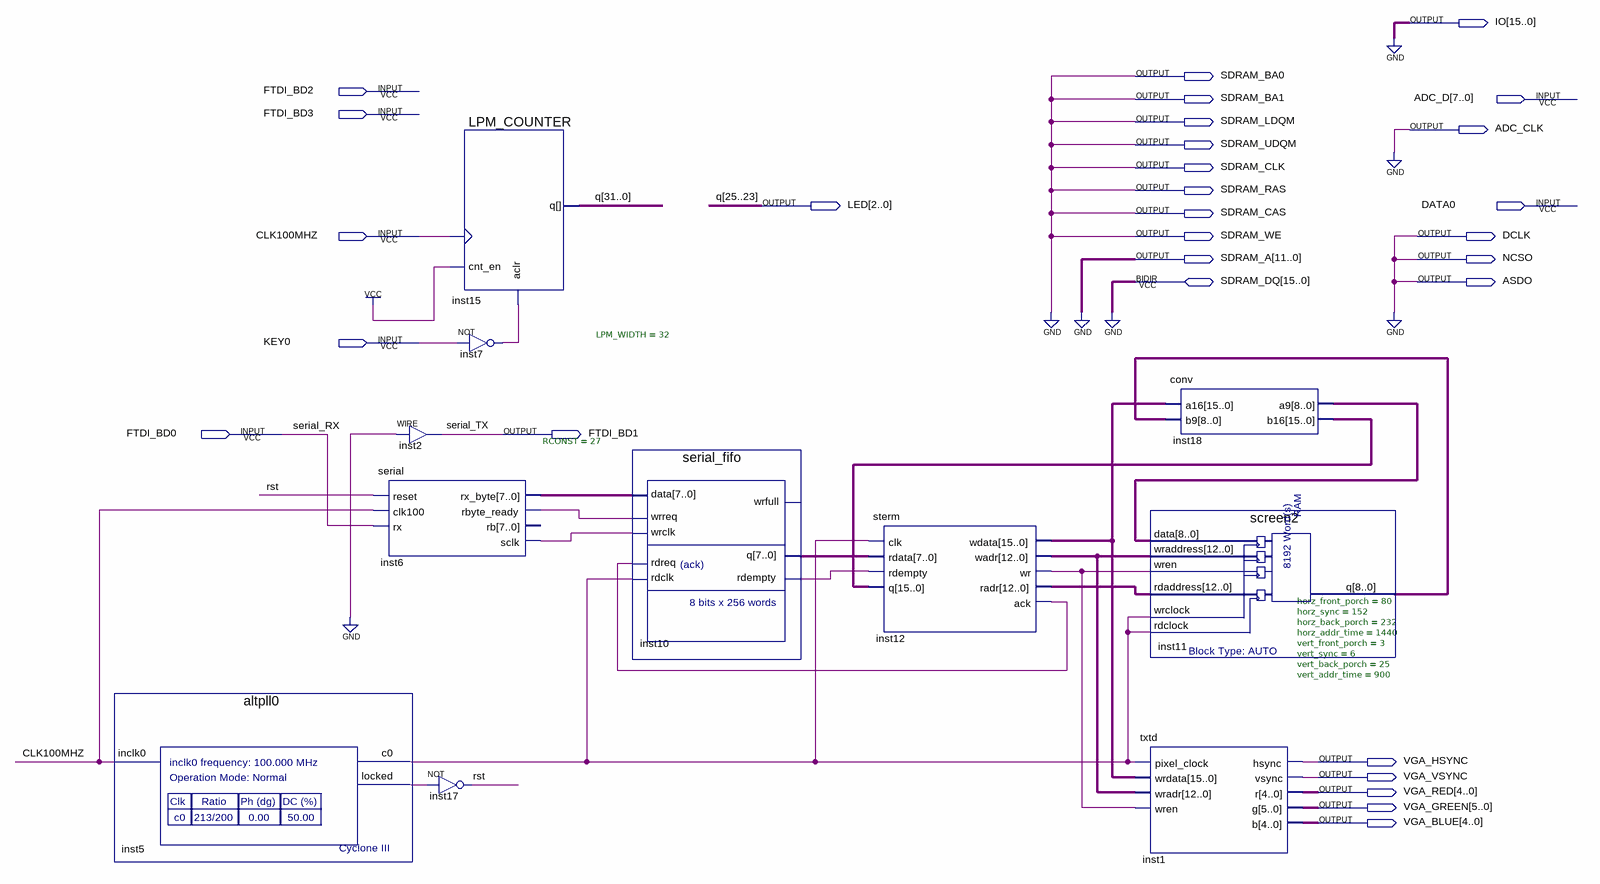
[diagram p0: schematic sheet]
// Quartus schematic cyclone3.bdf as structural Verilog: 11 symbols, 29 pins
module cyclone3 (
  input  FTDI_BD2,
  input  [7:0] ADC_D,
  input  FTDI_BD3,
  input  DATA0,
  input  CLK100MHZ,
  input  KEY0,
  input  FTDI_BD0,
  inout  [15:0] SDRAM_DQ,
  output [15:0] IO,
  output SDRAM_BA0,
  output SDRAM_BA1,
  output SDRAM_LDQM,
  output ADC_CLK,
  output SDRAM_UDQM,
  output SDRAM_CLK,
  output SDRAM_RAS,
  output [2:0] LED,
  output SDRAM_CAS,
  output SDRAM_WE,
  output DCLK,
  output [11:0] SDRAM_A,
  output NCSO,
  output ASDO,
  output FTDI_BD1,
  output VGA_HSYNC,
  output VGA_VSYNC,
  output [4:0] VGA_RED,
  output [5:0] VGA_GREEN,
  output [4:0] VGA_BLUE
);

  wire inst5_c0, inst5_locked, inst6_rbyte_ready, inst6_sclk, inst7_out, inst10_rdempty, inst12_ack,
       inst12_wr, rst;
  wire [7:0] inst6_rx_byte, inst10_q;
  wire [8:0] inst11_q, inst18_a9;
  wire [12:0] inst12_radr, inst12_wadr;
  wire [15:0] inst12_wdata, inst18_b16;
  wire [31:0] q;

  altpll0 inst5 (.inclk0(CLK100MHZ), .c0(inst5_c0), .locked(inst5_locked));
  assign FTDI_BD1 = 1'b0;  // WIRE inst2
  serial #(.RCONST(27)) inst6 (
    .reset(rst), .clk100(CLK100MHZ), .rx(FTDI_BD0), .rx_byte(inst6_rx_byte), .rbyte_ready(inst6_rbyte_ready),
    .sclk(inst6_sclk));  // open: rb
  LPM_COUNTER #(.LPM_WIDTH(32)) inst15 (
    .aclr(inst7_out), .clock(CLK100MHZ), .cnt_en(1'b1), .q({q[31:26], LED, q[22:0]}));
  not inst7 (inst7_out, KEY0);
  not inst17 (rst, inst5_locked);
  serial_fifo inst10 (
    .data(inst6_rx_byte), .wrreq(inst6_rbyte_ready), .wrclk(inst6_sclk), .rdreq(inst12_ack),
    .rdclk(inst5_c0), .q(inst10_q), .rdempty(inst10_rdempty));  // open: wrfull
  sterm inst12 (
    .clk(inst5_c0), .rdata(inst10_q), .rdempty(inst10_rdempty), .q(inst18_b16), .wdata(inst12_wdata),
    .wadr(inst12_wadr), .wr(inst12_wr), .radr(inst12_radr), .ack(inst12_ack));
  screen2 inst11 (
    .data(inst18_a9), .wraddress(inst12_wadr), .wren(inst12_wr), .rdaddress(inst12_radr), .wrclock(inst5_c0),
    .rdclock(inst5_c0), .q(inst11_q));
  txtd #(.horz_front_porch(80), .horz_sync(152), .horz_back_porch(232), .horz_addr_time(1440), .vert_front_porch(3), .vert_sync(6), .vert_back_porch(25), .vert_addr_time(900)) inst1 (
    .pixel_clock(inst5_c0), .wrdata(inst12_wdata), .wradr(inst12_wadr), .wren(inst12_wr), .hsync(VGA_HSYNC),
    .vsync(VGA_VSYNC), .r(VGA_RED), .g(VGA_GREEN), .b(VGA_BLUE));
  conv inst18 (.a16(inst12_wdata), .b9(inst11_q), .a9(inst18_a9), .b16(inst18_b16));

  assign ADC_CLK = 1'b0;
  assign ASDO = 1'b0;
  assign DCLK = 1'b0;
  assign IO = {16{1'b0}};
  assign NCSO = 1'b0;
  assign SDRAM_A = {12{1'b0}};
  assign SDRAM_BA0 = 1'b0;
  assign SDRAM_BA1 = 1'b0;
  assign SDRAM_CAS = 1'b0;
  assign SDRAM_CLK = 1'b0;
  assign SDRAM_LDQM = 1'b0;
  assign SDRAM_RAS = 1'b0;
  assign SDRAM_UDQM = 1'b0;
  assign SDRAM_WE = 1'b0;
  // also tied to GND on the sheet: {SDRAM_DQ[0], SDRAM_DQ[1], SDRAM_DQ[2], SDRAM_DQ[3], SDRAM_DQ[4], SDRAM_DQ[5], SDRAM_DQ[6], SDRAM_DQ[7], SDRAM_DQ[8], SDRAM_DQ[9], SDRAM_DQ[10], SDRAM_DQ[11], SDRAM_DQ[12], SDRAM_DQ[13], SDRAM_DQ[14], SDRAM_DQ[15]}

  // Other names for the same wires on the sheet: q[25:23] = LED; serial_RX = FTDI_BD0; serial_TX = FTDI_BD1
endmodule
